# Altium project UsbHub.PrjPcb
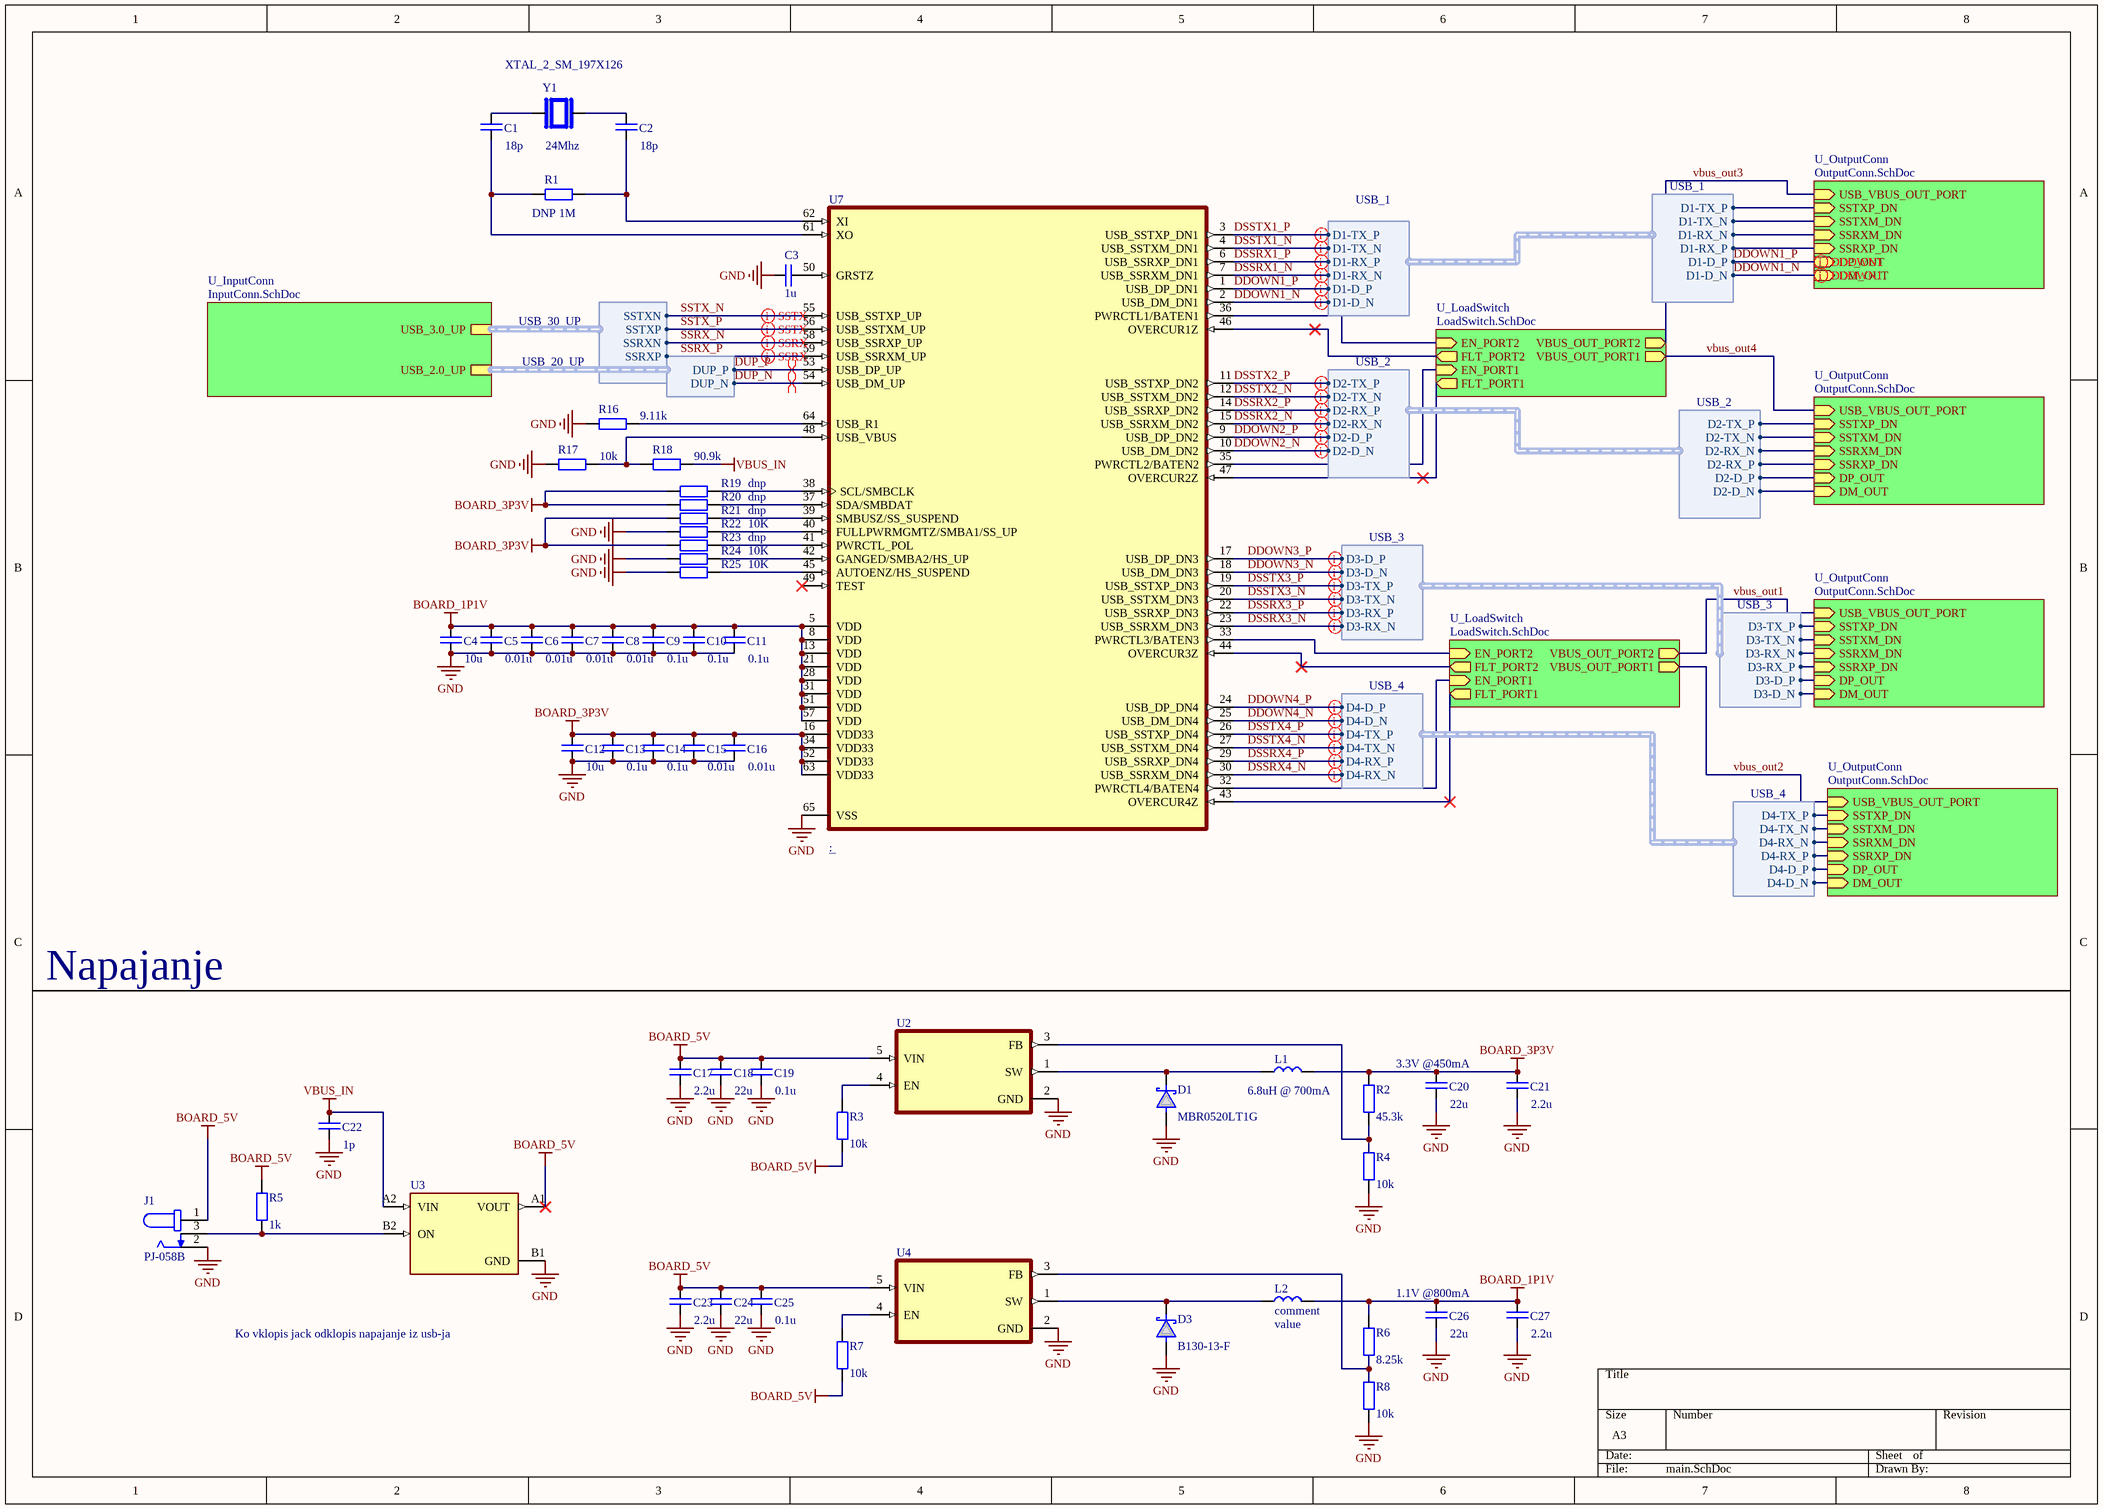
[diagram p0: main.SchDoc]
4 sheets, 122 parts. Net scope: hierarchical (ports join the sheet entries above them; power ports are global).
Board file: PCB1.PcbDoc
Sheets:
  main.SchDoc
    U_LoadSwitch = LoadSwitch.SchDoc
    U_OutputConn = OutputConn.SchDoc
    U_InputConn = InputConn.SchDoc
    U_LoadSwitch = LoadSwitch.SchDoc
    U_OutputConn = OutputConn.SchDoc
    U_OutputConn = OutputConn.SchDoc
    U_OutputConn = OutputConn.SchDoc

## Sheet main.SchDoc
size A3; SheetNumber: 1; SheetTotal: 4

### Parts
C1  value 18p  [CAP_0603_N]  (hidden comment: comment)
C2  value 18p  [CAP_0603_N]  (hidden comment: comment)
C3  value 1u  [CAP_0603_N]  (hidden comment: comment)
C4  value 10u  [CAP_0603_N]  (hidden comment: comment)
C5  value 0.01u  [CAP_0603_N]  (hidden comment: comment)
C6  value 0.01u  [CAP_0603_N]  (hidden comment: comment)
C7  value 0.01u  [CAP_0603_N]  (hidden comment: comment)
C8  value 0.01u  [CAP_0603_N]  (hidden comment: comment)
C9  value 0.1u  [CAP_0603_N]  (hidden comment: comment)
C10  value 0.1u  [CAP_0603_N]  (hidden comment: comment)
C11  value 0.1u  [CAP_0603_N]  (hidden comment: comment)
C12  value 10u  [CAP_0603_N]  (hidden comment: comment)
C13  value 0.1u  [CAP_0603_N]  (hidden comment: comment)
C14  value 0.1u  [CAP_0603_N]  (hidden comment: comment)
C15  value 0.01u  [CAP_0603_N]  (hidden comment: comment)
C16  value 0.01u  [CAP_0603_N]  (hidden comment: comment)
C17  value 2.2u  [CAP_0603_N]  (hidden comment: comment)
C18  value 22u  [CAP_0603_N]  (hidden comment: comment)
C19  value 0.1u  [CAP_0603_N]  (hidden comment: comment)
C20  value 22u  [CAP_0603_N]  (hidden comment: comment)
C21  value 2.2u  [CAP_0603_N]  (hidden comment: comment)
C22  value 1p  [CAP_0603_N]  (hidden comment: comment)
C23  value 2.2u  [CAP_0603_N]  (hidden comment: comment)
C24  value 22u  [CAP_0603_N]  (hidden comment: comment)
C25  value 0.1u  [CAP_0603_N]  (hidden comment: comment)
C26  value 22u  [CAP_0603_N]  (hidden comment: comment)
C27  value 2.2u  [CAP_0603_N]  (hidden comment: comment)
D1  value MBR0520LT1G  [SOD-123_N]  (hidden comment: comment)
D3  value B130-13-F  [SOD-123_N]  (hidden comment: comment)
J1  PJ-058B  [CUI_PJ-058B]
L1  value 6.8uH @ 700mA  [SMD_1206_N]  (hidden comment: comment)
L2  comment  [SMD_0603_N]
R1  DNP  value 1M  [SMD_0603_N]
R2  value 45.3k  [SMD_0603_N]  (hidden comment: comment)
R3  value 10k  [SMD_0603_N]  (hidden comment: comment)
R4  value 10k  [SMD_0603_N]  (hidden comment: comment)
R5  value 1k  [SMD_0603_N]  (hidden comment: comment)
R6  value 8.25k  [SMD_0603_N]  (hidden comment: comment)
R7  value 10k  [SMD_0603_N]  (hidden comment: comment)
R8  value 10k  [SMD_0603_N]  (hidden comment: comment)
R16  value 9.11k  [SMD_0603_N]  (hidden comment: DNP)
R17  value 10k  [SMD_0603_N]  (hidden comment: DNP)
R18  value 90.9k  [SMD_0603_N]  (hidden comment: DNP)
R19  DNP  [SMD_0603_N]
R20  DNP  [SMD_0603_N]
R21  DNP  [SMD_0603_N]
R22  value 10K  [SMD_0603_N]  (hidden comment: DNP)
R23  DNP  [SMD_0603_N]
R24  value 10K  [SMD_0603_N]  (hidden comment: DNP)
R25  value 10K  [SMD_0603_N]  (hidden comment: DNP)
U2  (no value)  [SOT95P280X145-5N]
U3  (no value)  [BGA4N50P2X2_88X88X50N]
U4  (no value)  [SOT95P280X145-5N]
U7  (no value)  [QFN50P900X900X100-65N]
Y1  XTAL_2_SM_197X126  value 24Mhz  [XTAL_CC7V-T1A-32.768KHZ-12.5PF-100PPM-TA-QC]

### Sub-sheets
U_InputConn = InputConn.SchDoc: USB_2.0_UP (harness USB_20_UP), USB_3.0_UP (harness USB_30_UP)
U_LoadSwitch = LoadSwitch.SchDoc: EN_PORT2 (in), EN_PORT1 (in), VBUS_OUT_PORT2 (out), VBUS_OUT_PORT1 (out), FLT_PORT2 (out), FLT_PORT1 (out)
U_LoadSwitch = LoadSwitch.SchDoc: EN_PORT2 (in), EN_PORT1 (in), VBUS_OUT_PORT2 (out), VBUS_OUT_PORT1 (out), FLT_PORT2 (out), FLT_PORT1 (out)
U_OutputConn = OutputConn.SchDoc: USB_VBUS_OUT_PORT (in), SSTXP_DN (in), SSTXM_DN (in), SSRXM_DN (in), SSRXP_DN (in), DP_OUT (in), DM_OUT (in)
U_OutputConn = OutputConn.SchDoc: USB_VBUS_OUT_PORT (in), SSTXP_DN (in), SSTXM_DN (in), SSRXM_DN (in), SSRXP_DN (in), DP_OUT (in), DM_OUT (in)
U_OutputConn = OutputConn.SchDoc: USB_VBUS_OUT_PORT (in), SSTXP_DN (in), SSTXM_DN (in), SSRXM_DN (in), SSRXP_DN (in), DP_OUT (in), DM_OUT (in)
U_OutputConn = OutputConn.SchDoc: USB_VBUS_OUT_PORT (in), SSTXP_DN (in), SSTXM_DN (in), SSRXM_DN (in), SSRXP_DN (in), DP_OUT (in), DM_OUT (in)

### Harnesses
USB_20_UP: DUP_N, DUP_P
USB_30_UP: SSRXN, SSRXP, SSTXN, SSTXP
USB_1: D1-D_P, D1-D_N, D1-RX_P, D1-RX_N, D1-TX_P, D1-TX_N
USB_2: D2-D_P, D2-D_N, D2-RX_P, D2-RX_N, D2-TX_P, D2-TX_N
USB_3: D3-D_P, D3-D_N, D3-RX_P, D3-RX_N, D3-TX_P, D3-TX_N
USB_4: D4-D_P, D4-D_N, D4-RX_P, D4-RX_N, D4-TX_P, D4-TX_N

### Nets
BOARD_1P1V: C4.1 C5.1 C6.1 C7.1 C8.1 C9.1 C10.1 C11.1 C26.1 C27.1 L2.2 R6.1 U7.5(VDD) U7.8(VDD) U7.13(VDD) U7.21(VDD) U7.28(VDD) U7.31(VDD) U7.51(VDD) U7.57(VDD)
BOARD_3P3V: C12.1 C13.1 C14.1 C15.1 C16.1 C20.1 C21.1 L1.2 R2.1 R19.1 R20.1 R21.1 R23.1 U7.16(VDD33) U7.34(VDD33) U7.52(VDD33) U7.63(VDD33)
BOARD_5V: C17.1 C18.1 C19.1 C23.1 C24.1 C25.1 J1.1 R3.2 R5.1 R7.2 U2.5(VIN) U3.A1(VOUT) U4.5(VIN)
GND: C3.1 C4.2 C5.2 C6.2 C7.2 C8.2 C9.2 C10.2 C11.2 C12.2 C13.2 C14.2 C15.2 C16.2 C17.2 C18.2 C19.2 C20.2 C21.2 C22.2 C23.2 C24.2 C25.2 C26.2 C27.2 D1.A D3.A J1.2 R4.2 R8.2 R16.1 R17.1 R22.1 R24.1 R25.1 U2.2(GND) U3.B1(GND) U4.2(GND) U7.65(VSS)
VBUS_IN: C22.1 R18.2 U3.A2(VIN)
DDOWN1_N: U7.2(USB_DM_DN1) ; sheet U_OutputConn/DM_OUT, harness USB_1.D1-D_N  [project net DDDOWN_N]
DDOWN1_P: U7.1(USB_DP_DN1) ; sheet U_OutputConn/DP_OUT, harness USB_1.D1-D_P  [project net DDDOWN_P]
DDOWN2_N: U7.10(USB_DM_DN2) ; sheet U_OutputConn/DM_OUT, harness USB_2.D2-D_N  [project net DDDOWN_N]
DDOWN2_P: U7.9(USB_DP_DN2) ; sheet U_OutputConn/DP_OUT, harness USB_2.D2-D_P  [project net DDDOWN_P]
DDOWN3_N: U7.18(USB_DM_DN3) ; sheet U_OutputConn/DM_OUT, harness USB_3.D3-D_N  [project net DDDOWN_N]
DDOWN3_P: U7.17(USB_DP_DN3) ; sheet U_OutputConn/DP_OUT, harness USB_3.D3-D_P  [project net DDDOWN_P]
DDOWN4_N: U7.25(USB_DM_DN4) ; sheet U_OutputConn/DM_OUT, harness USB_4.D4-D_N  [project net DDDOWN_N]
DDOWN4_P: U7.24(USB_DP_DN4) ; sheet U_OutputConn/DP_OUT, harness USB_4.D4-D_P  [project net DDDOWN_P]
DSSRX1_N: U7.7(USB_SSRXM_DN1) ; sheet U_OutputConn/SSRXM_DN, harness USB_1.D1-RX_N
DSSRX1_P: U7.6(USB_SSRXP_DN1) ; sheet U_OutputConn/SSRXP_DN, harness USB_1.D1-RX_P
DSSRX2_N: U7.15(USB_SSRXM_DN2) ; sheet U_OutputConn/SSRXM_DN, harness USB_2.D2-RX_N
DSSRX2_P: U7.14(USB_SSRXP_DN2) ; sheet U_OutputConn/SSRXP_DN, harness USB_2.D2-RX_P
DSSRX3_N: U7.23(USB_SSRXM_DN3) ; sheet U_OutputConn/SSRXM_DN, harness USB_3.D3-RX_N
DSSRX3_P: U7.22(USB_SSRXP_DN3) ; sheet U_OutputConn/SSRXP_DN, harness USB_3.D3-RX_P
DSSRX4_N: U7.30(USB_SSRXM_DN4) ; sheet U_OutputConn/SSRXM_DN, harness USB_4.D4-RX_N
DSSRX4_P: U7.29(USB_SSRXP_DN4) ; sheet U_OutputConn/SSRXP_DN, harness USB_4.D4-RX_P
DSSTX1_N: U7.4(USB_SSTXM_DN1) ; sheet U_OutputConn/SSTXM_DN, harness USB_1.D1-TX_N
DSSTX1_P: U7.3(USB_SSTXP_DN1) ; sheet U_OutputConn/SSTXP_DN, harness USB_1.D1-TX_P
DSSTX2_N: U7.12(USB_SSTXM_DN2) ; sheet U_OutputConn/SSTXM_DN, harness USB_2.D2-TX_N
DSSTX2_P: U7.11(USB_SSTXP_DN2) ; sheet U_OutputConn/SSTXP_DN, harness USB_2.D2-TX_P
DSSTX3_N: U7.20(USB_SSTXM_DN3) ; sheet U_OutputConn/SSTXM_DN, harness USB_3.D3-TX_N
DSSTX3_P: U7.19(USB_SSTXP_DN3) ; sheet U_OutputConn/SSTXP_DN, harness USB_3.D3-TX_P
DSSTX4_N: U7.27(USB_SSTXM_DN4) ; sheet U_OutputConn/SSTXM_DN, harness USB_4.D4-TX_N
DSSTX4_P: U7.26(USB_SSTXP_DN4) ; sheet U_OutputConn/SSTXP_DN, harness USB_4.D4-TX_P
DUP_N: U7.54(USB_DM_UP) ; sheet U_InputConn/USB_2.0_UP.DUP_N
DUP_P: U7.53(USB_DP_UP) ; sheet U_InputConn/USB_2.0_UP.DUP_P
SSRX_N: U7.58(USB_SSRXP_UP) ; sheet U_InputConn/USB_3.0_UP.SSRXN
SSRX_P: U7.59(USB_SSRXM_UP) ; sheet U_InputConn/USB_3.0_UP.SSRXP
SSTX_N: U7.55(USB_SSTXP_UP) ; sheet U_InputConn/USB_3.0_UP.SSTXN
SSTX_P: U7.56(USB_SSTXM_UP) ; sheet U_InputConn/USB_3.0_UP.SSTXP
vbus_out1: sheet U_LoadSwitch/VBUS_OUT_PORT2, sheet U_OutputConn/USB_VBUS_OUT_PORT
vbus_out2: sheet U_LoadSwitch/VBUS_OUT_PORT1, sheet U_OutputConn/USB_VBUS_OUT_PORT
vbus_out3: sheet U_LoadSwitch/VBUS_OUT_PORT2, sheet U_OutputConn/USB_VBUS_OUT_PORT
vbus_out4: sheet U_LoadSwitch/VBUS_OUT_PORT1, sheet U_OutputConn/USB_VBUS_OUT_PORT
NetC1_1: C1.1 Y1.1
NetC1_2: C1.2 R1.1 U7.61(XO)
NetC2_1: C2.1 Y1.2
NetC2_2: C2.2 R1.2 U7.62(XI)
NetC3_2: C3.2 U7.50(GRSTZ)
NetD1_C: D1.C L1.1 U2.1(SW)
NetD3_C: D3.C L2.1 U4.1(SW)
NetJ1_3: J1.3 R5.2 U3.B2(ON)
NetR2_2: R2.2 R4.1 U2.3(FB)
NetR3_1: R3.1 U2.4(EN)
NetR6_2: R6.2 R8.1 U4.3(FB)
NetR7_1: R7.1 U4.4(EN)
NetR9_U_LoadSwitch#1_1: U7.46(OVERCUR1Z) ; sheet U_LoadSwitch/FLT_PORT2
NetR9_U_LoadSwitch#2_1: U7.44(OVERCUR3Z) ; sheet U_LoadSwitch/FLT_PORT2
NetR10_U_LoadSwitch#1_1: U7.47(OVERCUR2Z) ; sheet U_LoadSwitch/FLT_PORT1
NetR10_U_LoadSwitch#2_1: U7.43(OVERCUR4Z) ; sheet U_LoadSwitch/FLT_PORT1
NetR11_U_LoadSwitch#1_1: U7.36(PWRCTL1/BATEN1) ; sheet U_LoadSwitch/EN_PORT2
NetR11_U_LoadSwitch#2_1: U7.33(PWRCTL3/BATEN3) ; sheet U_LoadSwitch/EN_PORT2
NetR12_U_LoadSwitch#1_1: U7.35(PWRCTL2/BATEN2) ; sheet U_LoadSwitch/EN_PORT1
NetR12_U_LoadSwitch#2_1: U7.32(PWRCTL4/BATEN4) ; sheet U_LoadSwitch/EN_PORT1
NetR16_2: R16.2 U7.64(USB_R1)
NetR17_2: R17.2 R18.1 U7.48(USB_VBUS)
NetR19_2: R19.2 U7.38(SCL/SMBCLK)
NetR20_2: R20.2 U7.37(SDA/SMBDAT)
NetR21_2: R21.2 U7.39(SMBUSZ/SS_SUSPEND)
NetR22_2: R22.2 U7.40(FULLPWRMGMTZ/SMBA1/SS_UP)
NetR23_2: R23.2 U7.41(PWRCTL_POL)
NetR24_2: R24.2 U7.42(GANGED/SMBA2/HS_UP)
NetR25_2: R25.2 U7.45(AUTOENZ/HS_SUSPEND)

Not connected (* = marked no-connect by the designer): U7 49(TEST)*

### Layout directives
differential pair: DDDOWN_N, DDDOWN_P, DSSRX1_N, DSSRX1_P, DSSRX2_N, DSSRX2_P, DSSRX3_N, DSSRX3_P, DSSRX4_N, DSSRX4_P, DSSTX1_N, DSSTX1_P, DSSTX2_N, DSSTX2_P, DSSTX3_N, DSSTX3_P, DSSTX4_N, DSSTX4_P, DUP_N, DUP_P, SSRX_N, SSRX_P, SSTX_N, SSTX_P

### Notes on the sheet
- Napajanje
- (near C20) 3.3V @450mA
- (near C26) 1.1V @800mA
- Ko vklopis jack odklopis napajanje iz usb-ja

### Library data of the parts
C1-C27 = Capacitor non-polarized
D1 D3 = Diode Schottky
J1 = PJ-058B: 2.5 mm Center Pin, 2.5 A, Right Angle, Through Hole, Locking Type, Dc Power Jack Connector; MP: PJ-058B; Package: None; Price: None; Availability: Unavailable; Value: *
L1 L2 = Inductor
  L2: Value: value
R1-R8 R16-R25 = Resistor
  R19-R21 R23: Value: dnp
U2 U4 = LMR10510XMFX/NOPB: Package: None; Price: None; Value: *; MP: LMR10510XMFX/NOPB; Availability: Unavailable
U3 = TPS22910AYZVR: 5.5V, 2A, 61m? Active-Low Load Switch With Reverse Current Protection; Price: None; Package: None; Availability: Unavailable; MP: TPS22910AYZVR; Value: *
U7 = TUSB8041RGCR: 4-port 5-Gbps SuperSpeed USB 3.0 hub 64-VQFN 0 to 70; MF: Texas Instruments; Texas_Instruments-Purchase-URL: https://snapeda.com/shop?store=Texas+Instruments&id=104660; Arrow_Electronics-Purchase-URL: https://snapeda.com/shop?store=Arrow+Electronics&id=104660; Package: VQFN-64 Texas Instruments; Value: *; SnapEDA_Link: https://www.snapeda.com/parts/TUSB8041RGCR/Texas%20Instruments/view-part/104660/?ref=snap; Price: None; MP: TUSB8041RGCR; Mouser-Purchase-URL: https://snapeda.com/shop?store=Mouser&id=104660; Availability: Good
Y1 = CC7V-T1A-32.768KHZ-12.5PF-100PPM-TA-QC: LOW FREQUENCY CRYSTAL; MF: Micro Crystal AG; Package: SMD-2 Micro Crystal; Price: None; Check_prices: https://www.snapeda.com/parts/CC7V-T1A-32.768KHZ-12.5PF-100PPM-TA-QC/Micro+Crystal/view-part/?ref=eda; SnapEDA_Link: https://www.snapeda.com/parts/CC7V-T1A-32.768KHZ-12.5PF-100PPM-TA-QC/Micro+Crystal/view-part/?ref=snap; MP: CC7V-T1A-32.768KHZ-12.5PF-100PPM-TA-QC; Availability: In Stock; Purchase-URL: https://pricing.snapeda.com/search/part/CC7V-T1A-32.768KHZ-12.5PF-100PPM-TA-QC/?ref=eda

## Sheet LoadSwitch.SchDoc
size A; SheetNumber: 2; SheetTotal: 4
Used 2 times, as channels U_LoadSwitch, U_LoadSwitch. Parts and nets are listed once, with the designators drawn on the sheet.
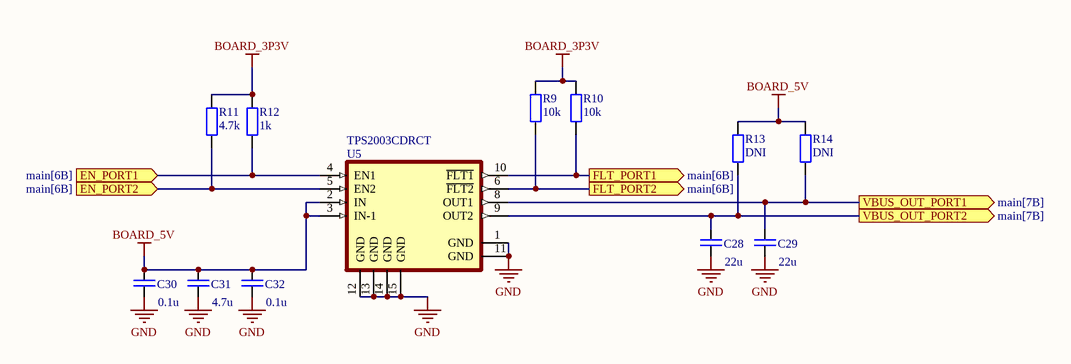
[diagram p1: LoadSwitch.SchDoc]

### Parts
C28  value 22u  [CAP_0603_N]  (hidden comment: comment)
C29  value 22u  [CAP_0603_N]  (hidden comment: comment)
C30  value 0.1u  [CAP_0603_N]  (hidden comment: comment)
C31  value 4.7u  [CAP_0603_N]  (hidden comment: comment)
C32  value 0.1u  [CAP_0603_N]  (hidden comment: comment)
R9  value 10k  [SMD_0603_N]  (hidden comment: comment)
R10  value 10k  [SMD_0603_N]  (hidden comment: comment)
R11  value 4.7k  [SMD_0603_N]  (hidden comment: comment)
R12  value 1k  [SMD_0603_N]  (hidden comment: comment)
R13  value DNI  [SMD_0603_N]  (hidden comment: comment)
R14  value DNI  [SMD_0603_N]  (hidden comment: comment)
U5  TPS2003CDRCT  [VREG_V62/16624-01YE]

### Ports
EN_PORT1 (in, see main[6B]), EN_PORT2 (in, see main[6B]), FLT_PORT1 (out, see main[6B]), FLT_PORT2 (out, see main[6B]), VBUS_OUT_PORT1 (out, see main[7B]), VBUS_OUT_PORT2 (out, see main[7B])

### Nets
BOARD_3P3V: R9.2 R10.2 R11.2 R12.2
BOARD_5V: C30.1 C31.1 C32.1 R13.2 R14.2 U5.2(IN) U5.3(IN-1)
GND: C28.2 C29.2 C30.2 C31.2 C32.2 U5.1(GND) U5.11(GND) U5.12(GND) U5.13(GND) U5.14(GND) U5.15(GND)
EN_PORT1: R12.1 U5.4(EN1) ; port EN_PORT1
EN_PORT2: R11.1 U5.5(EN2) ; port EN_PORT2
FLT_PORT1: R10.1 U5.10(~{FLT1}) ; port FLT_PORT1
FLT_PORT2: R9.1 U5.6(~{FLT2}) ; port FLT_PORT2
VBUS_OUT_PORT1: C29.1 R14.1 U5.8(OUT1) ; port VBUS_OUT_PORT1
VBUS_OUT_PORT2: C28.1 R13.1 U5.9(OUT2) ; port VBUS_OUT_PORT2

### Channels
U_LoadSwitch: designators end in _U_LoadSwitch#1; ports EN_PORT1=NetR12_U_LoadSwitch#1_1 EN_PORT2=NetR11_U_LoadSwitch#1_1 FLT_PORT1=NetR10_U_LoadSwitch#1_1 FLT_PORT2=NetR9_U_LoadSwitch#1_1 VBUS_OUT_PORT1=vbus_out4 VBUS_OUT_PORT2=vbus_out3
U_LoadSwitch: designators end in _U_LoadSwitch#2; ports EN_PORT1=NetR12_U_LoadSwitch#2_1 EN_PORT2=NetR11_U_LoadSwitch#2_1 FLT_PORT1=NetR10_U_LoadSwitch#2_1 FLT_PORT2=NetR9_U_LoadSwitch#2_1 VBUS_OUT_PORT1=vbus_out2 VBUS_OUT_PORT2=vbus_out1

### Library data of the parts
C28-C32 = Capacitor non-polarized
R9-R14 = Resistor
U5 = TPS2003CDRCT: Package: None; Price: None; Value: *; MP: TPS2003CDRCT; Availability: Unavailable

## Sheet OutputConn.SchDoc
size A; SheetNumber: 3; SheetTotal: 4
Used 4 times, as channels U_OutputConn, U_OutputConn, U_OutputConn, U_OutputConn. Parts and nets are listed once, with the designators drawn on the sheet.
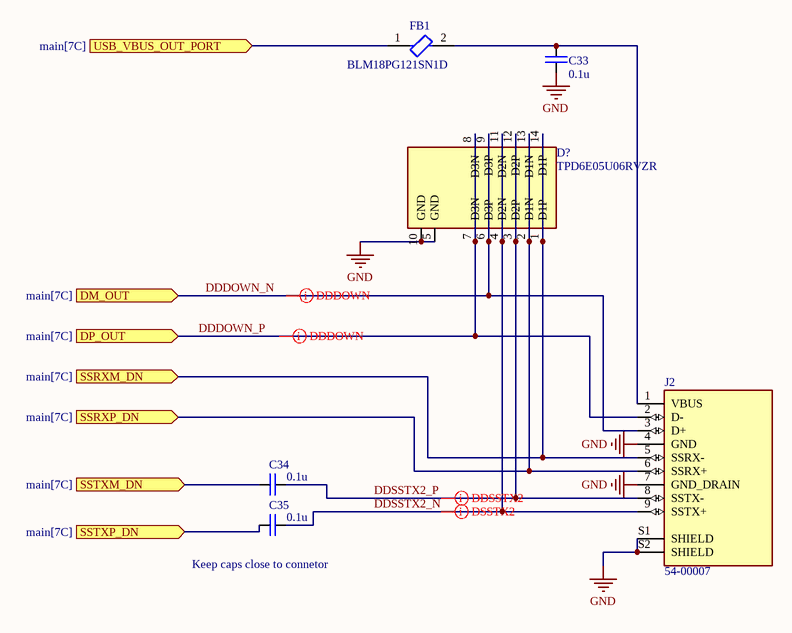
[diagram p2: OutputConn.SchDoc]

### Parts
C33  value 0.1u  [CAP_0603_N]  (hidden comment: comment)
C34  value 0.1u  [CAP_0603_N]  (hidden comment: comment)
C35  value 0.1u  [CAP_0603_N]  (hidden comment: comment)
D?  TPD6E05U06RVZR  [SON50P135X350X55-14N]
FB1  BLM18PG121SN1D  [FP-BLM18-0_15-t0_8-IPC_B]
J2  54-00007  [TENSILITY_54-00007]

### Ports
DM_OUT (in, see main[7C]), DP_OUT (in, see main[7C]), SSRXM_DN (in, see main[7C]), SSRXP_DN (in, see main[7C]), SSTXM_DN (in, see main[7C]), SSTXP_DN (in, see main[7C]), USB_VBUS_OUT_PORT (in, see main[7C])

### Nets
GND: C33.1 D?.5(GND) D?.10(GND) J2.4(GND) J2.7(GND_DRAIN) J2.S1(SHIELD) J2.S2(SHIELD)
DDDOWN_N: D?.6(D3P) D?.9(D3P) J2.3(D+) ; port DM_OUT
DDDOWN_P: D?.7(D3N) D?.8(D3N) J2.2(D-) ; port DP_OUT
DDSSTX2_N: C35.2 D?.4(D2N) D?.11(D2N) J2.9(SSTX+)
DDSSTX2_P: C34.2 D?.3(D2P) D?.12(D2P) J2.8(SSTX-)
SSRXM_DN: D?.1(D1P) D?.14(D1P) J2.5(SSRX-) ; port SSRXM_DN
SSRXP_DN: D?.2(D1N) D?.13(D1N) J2.6(SSRX+) ; port SSRXP_DN
SSTXM_DN: C34.1 ; port SSTXM_DN
SSTXP_DN: C35.1 ; port SSTXP_DN
USB_VBUS_OUT_PORT: FB1.1 ; port USB_VBUS_OUT_PORT
NetC33_2: C33.2 FB1.2 J2.1(VBUS)

### Channels
U_OutputConn: designators end in _U_OutputConn#1; ports DM_OUT=DDDOWN_N DP_OUT=DDDOWN_P SSRXM_DN=DSSRX1_N SSRXP_DN=DSSRX1_P SSTXM_DN=DSSTX1_N SSTXP_DN=DSSTX1_P USB_VBUS_OUT_PORT=vbus_out3
U_OutputConn: designators end in _U_OutputConn#2; ports DM_OUT=DDDOWN_N DP_OUT=DDDOWN_P SSRXM_DN=DSSRX2_N SSRXP_DN=DSSRX2_P SSTXM_DN=DSSTX2_N SSTXP_DN=DSSTX2_P USB_VBUS_OUT_PORT=vbus_out4
U_OutputConn: designators end in _U_OutputConn#3; ports DM_OUT=DDDOWN_N DP_OUT=DDDOWN_P SSRXM_DN=DSSRX3_N SSRXP_DN=DSSRX3_P SSTXM_DN=DSSTX3_N SSTXP_DN=DSSTX3_P USB_VBUS_OUT_PORT=vbus_out1
U_OutputConn: designators end in _U_OutputConn#4; ports DM_OUT=DDDOWN_N DP_OUT=DDDOWN_P SSRXM_DN=DSSRX4_N SSRXP_DN=DSSRX4_P SSTXM_DN=DSSTX4_N SSTXP_DN=DSSTX4_P USB_VBUS_OUT_PORT=vbus_out2

### Layout directives
differential pair: DDDOWN_N, DDDOWN_P, DDSSTX2_N_U_OutputConn, DDSSTX2_P_U_OutputConn

### Notes on the sheet
- (near C35) Keep caps close to connetor

### Library data of the parts
C33-C35 = Capacitor non-polarized
D? = TPD6E05U06RVZR: 6-Channel Ultra low capacitance IEC ESD protection diodes 14-USON -40 to 125; MP: TPD6E05U06RVZR; Price: None; Package: None; Value: *; Availability: Unavailable
FB1 = CMP-0686-00557-7: Chip Ferrite Bead, 0603, 120Ω @ 100MHz, 0.05Ω, 25%, 2A; Impedance: 120R; Number of Circuits: 1; Shielding: Unshielded; Material: Steel; DC Resistance (DCR): 50mR; Case Code (Imperial): 0603; RoHS Compliant: Yes; Number of Pins: 2; Min Operating Temperature: -55°C; Case Code (Metric): 1608; Frequency: 100MHz; Length: 1.6mm; Test Frequency: 100MHz; Max Operating Temperature: 125°C; Packaging: Tape and Reel; Max Current Rating: 2A; Termination: SMD/SMT; Lead Free: Lead Free; Max DC Current: 2A; Case/Package: 0603; Height: 0.8mm; Current Rating: 2A; Radiation Hardening: No; Core Material: Ferrite; DC Current: 2A; REACH SVHC: No SVHC; Package Quantity: 1; Depth: 0.8mm; Number of Lines: 1; Tolerance: 25%; Width: 0.8mm
J2 = 54-00007: Connector, USB A 3.0 Jack, PCB mount, 90 degrees, nickel shell, DIP, board lock, blue insulator, tray; MF: Tensility International Corp; SnapEDA_Link: https://www.snapeda.com/parts/54-00007/Tensility+International+Corp/view-part/?ref=snap; Package: None; Value: *; MP: 54-00007; Check_prices: https://www.snapeda.com/parts/54-00007/Tensility+International+Corp/view-part/?ref=eda

## Sheet InputConn.SchDoc
size A; SheetNumber: 4; SheetTotal: 4
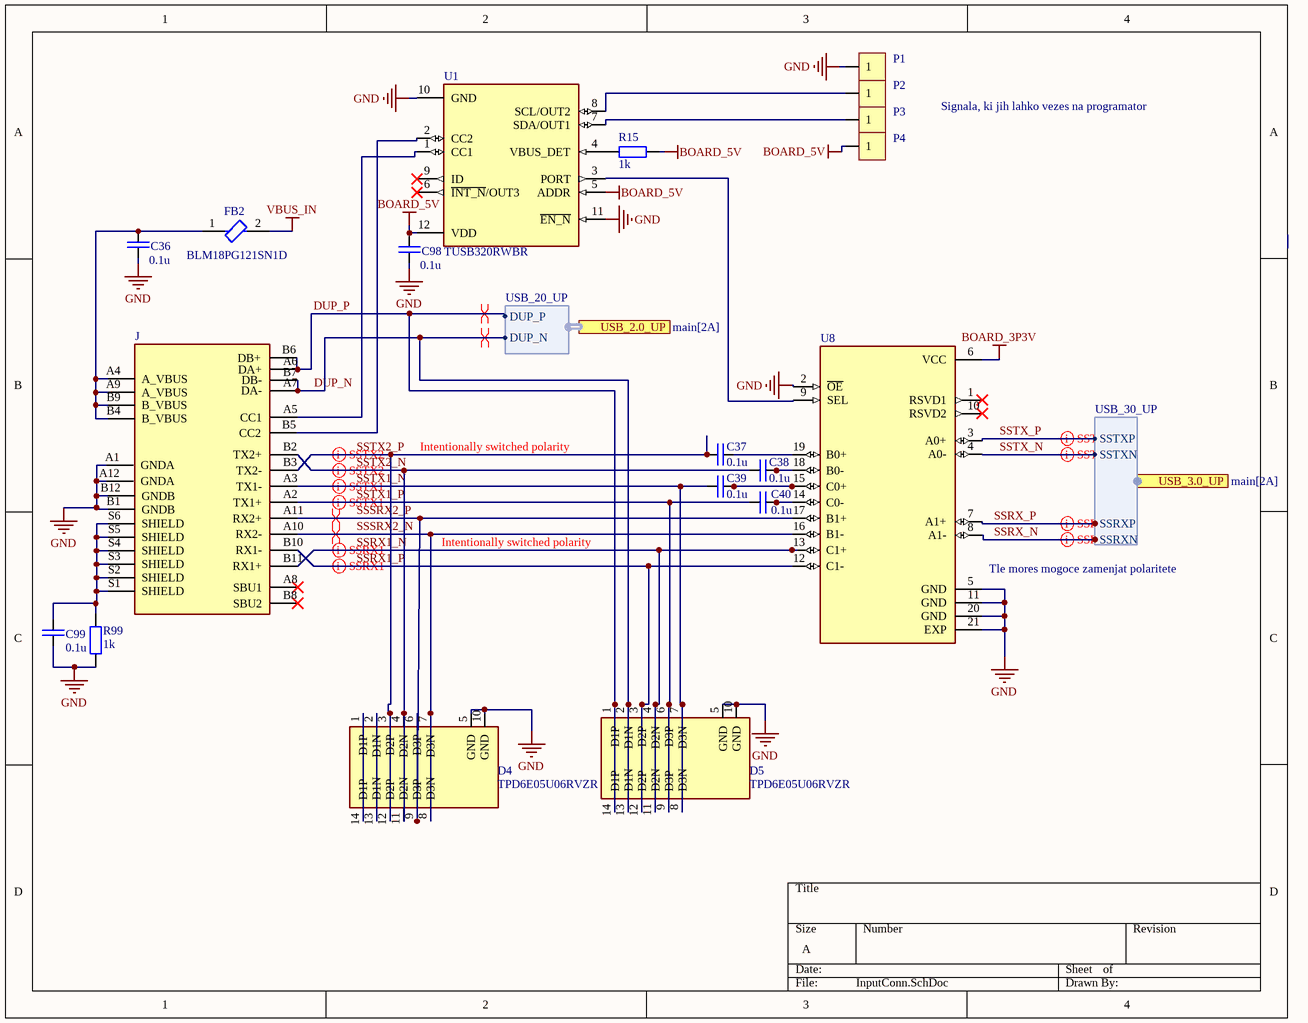
[diagram p3: InputConn.SchDoc]

### Parts
C36  value 0.1u  [CAP_0603_N]  (hidden comment: comment)
C37  value 0.1u  [CAP_0603_N]  (hidden comment: comment)
C38  value 0.1u  [CAP_0603_N]  (hidden comment: comment)
C39  value 0.1u  [CAP_0603_N]  (hidden comment: comment)
C40  value 0.1u  [CAP_0603_N]  (hidden comment: comment)
C98  value 0.1u  [CAP_0603_N]  (hidden comment: comment)
C99  value 0.1u  [CAP_0603_N]  (hidden comment: comment)
D4  TPD6E05U06RVZR  [SON50P135X350X55-14N]
D5  TPD6E05U06RVZR  [SON50P135X350X55-14N]
FB2  BLM18PG121SN1D  [FP-BLM18-0_15-t0_8-IPC_B]
J  (no value)  [JAE_DX07B024JJ3R1600]
P1  H1x1  [HDR1X1]  (value not drawn)
P2  H1x1  [HDR1X1]  (value not drawn)
P3  H1x1  [HDR1X1]  (value not drawn)
P4  H1x1  [HDR1X1]  (value not drawn)
R15  value 1k  [SMD_0603_N]  (hidden comment: comment)
R99  value 1k  [SMD_0603_N]  (hidden comment: comment)
U1  TUSB320RWBR  [IC_TUSB320RWBR]
U8  (no value)  [QFN50P450X250X100-21N]

### Ports
USB_2.0_UP (harness USB_20_UP, see main[2A]), USB_3.0_UP (harness USB_30_UP, see main[2A])

### Harnesses
USB_30_UP: SSTXP, SSTXN, SSRXP, SSRXN
USB_20_UP: DUP_P, DUP_N

### Nets
BOARD_3P3V: U8.6(VCC)
BOARD_5V: C98.1 P4.1 R15.2 U1.5(ADDR) U1.12(VDD)
GND: C36.2 C98.2 C99.1 D4.5(GND) D4.10(GND) D5.5(GND) D5.10(GND) J.A1(GNDA) J.A12(GNDA) J.B1(GNDB) J.B12(GNDB) P1.1 R99.1 U1.10(GND) U1.11(~{EN_N}) U8.2(~{OE}) U8.5(GND) U8.11(GND) U8.20(GND) U8.21(EXP)
VBUS_IN: FB2.2
DUP_N: D5.2(D1N) D5.13(D1N) J.A7(DA-) J.B7(DB-) ; port USB_2.0_UP.DUP_N
DUP_P: D5.1(D1P) D5.14(D1P) J.A6(DA+) J.B6(DB+) ; port USB_2.0_UP.DUP_P
SSRX1_N: D5.4(D2N) D5.11(D2N) J.B11(RX1+) U8.13(C1+)
SSRX1_P: D5.3(D2P) D5.12(D2P) J.B10(RX1-) U8.12(C1-)
SSRX_N: U8.8(A1-) ; port USB_3.0_UP.SSRXN
SSRX_P: U8.7(A1+) ; port USB_3.0_UP.SSRXP
SSSRX2_N: D4.7(D3N) D4.8(D3N) J.A10(RX2-) U8.16(B1-)
SSSRX2_P: D4.6(D3P) D4.9(D3P) J.A11(RX2+) U8.17(B1+)
SSTX1_N: C39.1 D5.7(D3N) D5.8(D3N) J.A3(TX1-)
SSTX1_P: C40.1 D5.6(D3P) D5.9(D3P) J.A2(TX1+)
SSTX2_N: C38.1 D4.4(D2N) D4.11(D2N) J.B2(TX2+)
SSTX2_P: C37.1 D4.3(D2P) D4.12(D2P) J.B3(TX2-)
SSTX_N: U8.4(A0-) ; port USB_3.0_UP.SSTXN
SSTX_P: U8.3(A0+) ; port USB_3.0_UP.SSTXP
NetC36_1: C36.1 FB2.1 J.A4(A_VBUS) J.A9(A_VBUS) J.B4(B_VBUS) J.B9(B_VBUS)
NetC37_2: C37.2 U8.19(B0+)
NetC38_2: C38.2 U8.18(B0-)
NetC39_2: C39.2 U8.15(C0+)
NetC40_2: C40.2 U8.14(C0-)
NetC99_2: C99.2 J.S1(SHIELD) J.S2(SHIELD) J.S3(SHIELD) J.S4(SHIELD) J.S5(SHIELD) J.S6(SHIELD) R99.2
NetD4_1: D4.1(D1P) D4.14(D1P)
NetD4_2: D4.2(D1N) D4.13(D1N)
NetJ_A5: J.A5(CC1) U1.1(CC1)
NetJ_B5: J.B5(CC2) U1.2(CC2)
NetP2_1: P2.1 U1.8(SCL/OUT2)
NetP3_1: P3.1 U1.7(SDA/OUT1)
NetR15_1: R15.1 U1.4(VBUS_DET)
NetU1_3: U1.3(PORT) U8.9(SEL)

Not connected (* = marked no-connect by the designer): J A8(SBU1)* B8(SBU2)*; U1 6(~{INT_N}/OUT3)* 9(ID)*; U8 1(RSVD1)* 10(RSVD2)*

### Layout directives
differential pair: DUP_N, DUP_P, SSRX1_N, SSRX1_P, SSRX_N, SSRX_P, SSSRX2_N, SSSRX2_P, SSTX1_N, SSTX1_P, SSTX2_N, SSTX2_P, SSTX_N, SSTX_P

### Notes on the sheet
- Signala, ki jih lahko vezes na programator
- Intentionally switched polarity
- (near U8) Tle mores mogoce zamenjat polaritete

### Library data of the parts
C36-C40 C98 C99 = Capacitor non-polarized
D4 D5 = TPD6E05U06RVZR: as D? on sheet OutputConn; MP: TPD6E05U06RVZR; Price: None; Package: None; Value: *; Availability: Unavailable
FB2 = CMP-0686-00557-7: as FB1 on sheet OutputConn; Case Code (Imperial): 0603; RoHS Compliant: Yes; Number of Pins: 2; Min Operating Temperature: -55°C; Case Code (Metric): 1608; Frequency: 100MHz; Length: 1.6mm; Test Frequency: 100MHz; Max Operating Temperature: 125°C; Packaging: Tape and Reel; Max Current Rating: 2A; Termination: SMD/SMT; Lead Free: Lead Free; Max DC Current: 2A; Case/Package: 0603; Height: 0.8mm; Current Rating: 2A; Radiation Hardening: No; Core Material: Ferrite; DC Current: 2A; REACH SVHC: No SVHC; Package Quantity: 1; Depth: 0.8mm; Number of Lines: 1; Tolerance: 25%; Width: 0.8mm
J = DX07B024JJ3R1600: USB-C _USB TYPE-C_ USB 3.1 _USB 3.1 Gen 2, Superspeed+_ Receptacle Connector 24 Position Board Cutout, Surface Mount, Right Angle; Through Hole; MF: JAE Electronics; Availability: Unavailable; SnapEDA_Link: https://www.snapeda.com/parts/DX07B024JJ3R1600/JAE%20Electronics/view-part/631446/?ref=snap; MP: DX07B024JJ3R1600; Price: None; Package: None; Value: *
P1-P4 = Header 1X1: Value: value
R15 R99 = Resistor
U1 = TUSB320RWBR: USB Type-C configuration channel logic and port control; MF: Texas Instruments; SnapEDA_Link: https://www.snapeda.com/parts/TUSB320RWBR/Texas+Instruments/view-part/?ref=snap; Package: X2QFN-12 Texas Instruments; Value: *; MP: TUSB320RWBR; Check_prices: https://www.snapeda.com/parts/TUSB320RWBR/Texas+Instruments/view-part/?ref=eda
U8 = HD3SS3212RKSR: USB Switch IC 2 Channel 20-VQFN _4.5x2.5_; MF: Texas Instruments; Value: *; Availability: Unavailable; Package: VFQFN-20 Texas Instruments; SnapEDA_Link: https://www.snapeda.com/parts/HD3SS3212RKSR/Texas%20Instruments/view-part/563933/?ref=snap; Price: None; MP: HD3SS3212RKSR

## Nets that join several sheets
BOARD_3P3V: main (17 pins), U_LoadSwitch (R9_U_LoadSwitch#1.2 R10_U_LoadSwitch#1.2 R11_U_LoadSwitch#1.2 R12_U_LoadSwitch#1.2), InputConn (U8.6), U_LoadSwitch (R9_U_LoadSwitch#2.2 R10_U_LoadSwitch#2.2 R11_U_LoadSwitch#2.2 R12_U_LoadSwitch#2.2)
BOARD_5V: main (13 pins), U_LoadSwitch (7 pins), InputConn (5 pins), U_LoadSwitch (7 pins)
GND: main (39 pins), U_LoadSwitch (11 pins), U_OutputConn (7 pins), InputConn (20 pins), U_LoadSwitch (11 pins), U_OutputConn (7 pins), U_OutputConn (7 pins), U_OutputConn (7 pins)
VBUS_IN: main (C22.1 R18.2 U3.A2), InputConn (FB2.2)
DDDOWN_N: main (U7.2), U_OutputConn (D?_U_OutputConn#1.6 D?_U_OutputConn#1.9 J2_U_OutputConn#1.3)
DDDOWN_N: main (U7.10), U_OutputConn (D?_U_OutputConn#2.6 D?_U_OutputConn#2.9 J2_U_OutputConn#2.3)
DDDOWN_N: main (U7.18), U_OutputConn (D?_U_OutputConn#3.6 D?_U_OutputConn#3.9 J2_U_OutputConn#3.3)
DDDOWN_N: main (U7.25), U_OutputConn (D?_U_OutputConn#4.6 D?_U_OutputConn#4.9 J2_U_OutputConn#4.3)
DDDOWN_P: main (U7.1), U_OutputConn (D?_U_OutputConn#1.7 D?_U_OutputConn#1.8 J2_U_OutputConn#1.2)
DDDOWN_P: main (U7.9), U_OutputConn (D?_U_OutputConn#2.7 D?_U_OutputConn#2.8 J2_U_OutputConn#2.2)
DDDOWN_P: main (U7.17), U_OutputConn (D?_U_OutputConn#3.7 D?_U_OutputConn#3.8 J2_U_OutputConn#3.2)
DDDOWN_P: main (U7.24), U_OutputConn (D?_U_OutputConn#4.7 D?_U_OutputConn#4.8 J2_U_OutputConn#4.2)
DSSRX1_N: main (U7.7), U_OutputConn (D?_U_OutputConn#1.1 D?_U_OutputConn#1.14 J2_U_OutputConn#1.5)
DSSRX1_P: main (U7.6), U_OutputConn (D?_U_OutputConn#1.2 D?_U_OutputConn#1.13 J2_U_OutputConn#1.6)
DSSRX2_N: main (U7.15), U_OutputConn (D?_U_OutputConn#2.1 D?_U_OutputConn#2.14 J2_U_OutputConn#2.5)
DSSRX2_P: main (U7.14), U_OutputConn (D?_U_OutputConn#2.2 D?_U_OutputConn#2.13 J2_U_OutputConn#2.6)
DSSRX3_N: main (U7.23), U_OutputConn (D?_U_OutputConn#3.1 D?_U_OutputConn#3.14 J2_U_OutputConn#3.5)
DSSRX3_P: main (U7.22), U_OutputConn (D?_U_OutputConn#3.2 D?_U_OutputConn#3.13 J2_U_OutputConn#3.6)
DSSRX4_N: main (U7.30), U_OutputConn (D?_U_OutputConn#4.1 D?_U_OutputConn#4.14 J2_U_OutputConn#4.5)
DSSRX4_P: main (U7.29), U_OutputConn (D?_U_OutputConn#4.2 D?_U_OutputConn#4.13 J2_U_OutputConn#4.6)
DSSTX1_N: main (U7.4), U_OutputConn (C34_U_OutputConn#1.1)
DSSTX1_P: main (U7.3), U_OutputConn (C35_U_OutputConn#1.1)
DSSTX2_N: main (U7.12), U_OutputConn (C34_U_OutputConn#2.1)
DSSTX2_P: main (U7.11), U_OutputConn (C35_U_OutputConn#2.1)
DSSTX3_N: main (U7.20), U_OutputConn (C34_U_OutputConn#3.1)
DSSTX3_P: main (U7.19), U_OutputConn (C35_U_OutputConn#3.1)
DSSTX4_N: main (U7.27), U_OutputConn (C34_U_OutputConn#4.1)
DSSTX4_P: main (U7.26), U_OutputConn (C35_U_OutputConn#4.1)
DUP_N: main (U7.54), InputConn (D5.2 D5.13 J.A7 J.B7)
DUP_P: main (U7.53), InputConn (D5.1 D5.14 J.A6 J.B6)
NetR9_U_LoadSwitch#1_1: main (U7.46), U_LoadSwitch (R9_U_LoadSwitch#1.1 U5_U_LoadSwitch#1.6)
NetR9_U_LoadSwitch#2_1: main (U7.44), U_LoadSwitch (R9_U_LoadSwitch#2.1 U5_U_LoadSwitch#2.6)
NetR10_U_LoadSwitch#1_1: main (U7.47), U_LoadSwitch (R10_U_LoadSwitch#1.1 U5_U_LoadSwitch#1.10)
NetR10_U_LoadSwitch#2_1: main (U7.43), U_LoadSwitch (R10_U_LoadSwitch#2.1 U5_U_LoadSwitch#2.10)
NetR11_U_LoadSwitch#1_1: main (U7.36), U_LoadSwitch (R11_U_LoadSwitch#1.1 U5_U_LoadSwitch#1.5)
NetR11_U_LoadSwitch#2_1: main (U7.33), U_LoadSwitch (R11_U_LoadSwitch#2.1 U5_U_LoadSwitch#2.5)
NetR12_U_LoadSwitch#1_1: main (U7.35), U_LoadSwitch (R12_U_LoadSwitch#1.1 U5_U_LoadSwitch#1.4)
NetR12_U_LoadSwitch#2_1: main (U7.32), U_LoadSwitch (R12_U_LoadSwitch#2.1 U5_U_LoadSwitch#2.4)
SSRX_N: main (U7.58), InputConn (U8.8)
SSRX_P: main (U7.59), InputConn (U8.7)
SSTX_N: main (U7.55), InputConn (U8.4)
SSTX_P: main (U7.56), InputConn (U8.3)
vbus_out1: U_LoadSwitch (C28_U_LoadSwitch#2.1 R13_U_LoadSwitch#2.1 U5_U_LoadSwitch#2.9), U_OutputConn (FB1_U_OutputConn#3.1)
vbus_out2: U_LoadSwitch (C29_U_LoadSwitch#2.1 R14_U_LoadSwitch#2.1 U5_U_LoadSwitch#2.8), U_OutputConn (FB1_U_OutputConn#4.1)
vbus_out3: U_LoadSwitch (C28_U_LoadSwitch#1.1 R13_U_LoadSwitch#1.1 U5_U_LoadSwitch#1.9), U_OutputConn (FB1_U_OutputConn#1.1)
vbus_out4: U_LoadSwitch (C29_U_LoadSwitch#1.1 R14_U_LoadSwitch#1.1 U5_U_LoadSwitch#1.8), U_OutputConn (FB1_U_OutputConn#2.1)